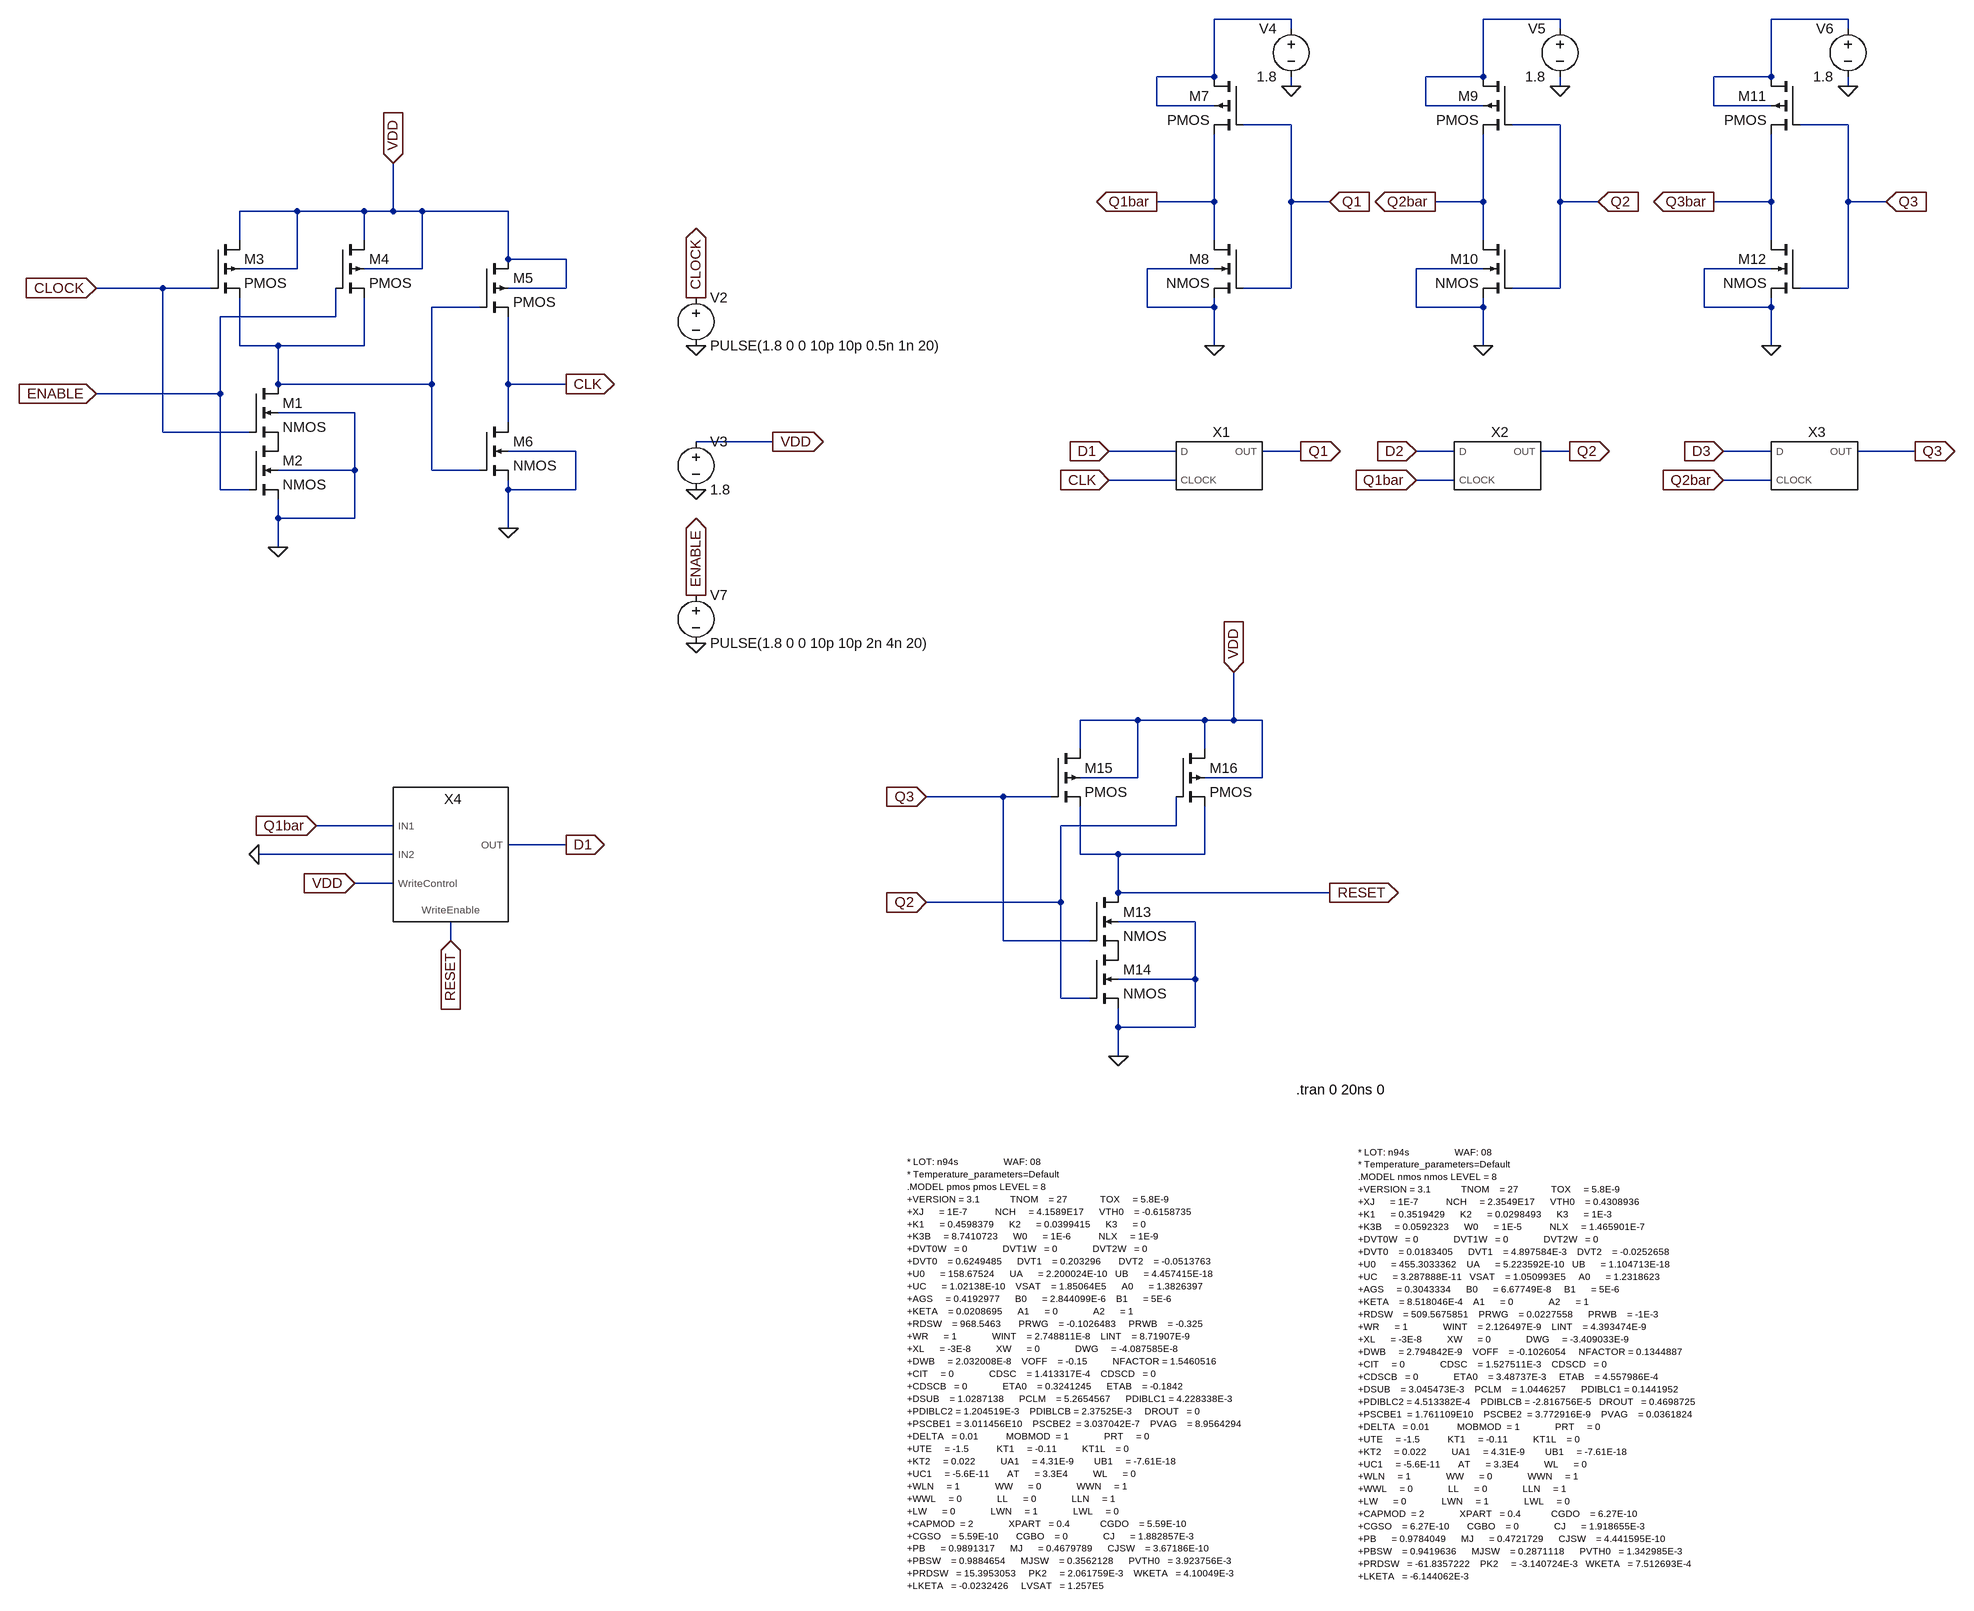
[diagram p0: schematic Mod5_Counter7.asc]
Mod5_Counter7.asc, the LTspice schematic file:
Version 4
SHEET 1 2608 2384
WIRE 16 -208 -112 -208
WIRE 464 -208 336 -208
WIRE 944 -208 816 -208
WIRE 16 -192 16 -208
WIRE 464 -192 464 -208
WIRE 944 -192 944 -208
WIRE -112 -112 -112 -208
WIRE -112 -112 -208 -112
WIRE 336 -112 336 -208
WIRE 336 -112 240 -112
WIRE 816 -112 816 -208
WIRE 816 -112 720 -112
WIRE 16 -96 16 -112
WIRE 464 -96 464 -112
WIRE 944 -96 944 -112
WIRE -208 -64 -208 -112
WIRE -112 -64 -208 -64
WIRE 240 -64 240 -112
WIRE 336 -64 240 -64
WIRE 720 -64 720 -112
WIRE 816 -64 720 -64
WIRE 16 -32 -64 -32
WIRE 464 -32 384 -32
WIRE 944 -32 864 -32
WIRE -112 96 -112 -16
WIRE -112 96 -208 96
WIRE 16 96 16 -32
WIRE 80 96 16 96
WIRE 336 96 336 -16
WIRE 336 96 256 96
WIRE 464 96 464 -32
WIRE 528 96 464 96
WIRE 816 96 816 -16
WIRE 816 96 720 96
WIRE 944 96 944 -32
WIRE 1008 96 944 96
WIRE -1744 112 -1840 112
WIRE -1632 112 -1744 112
WIRE -1584 112 -1584 32
WIRE -1584 112 -1632 112
WIRE -1536 112 -1584 112
WIRE -1392 112 -1536 112
WIRE -1840 160 -1840 112
WIRE -1632 160 -1632 112
WIRE -112 160 -112 96
WIRE 336 160 336 96
WIRE 816 160 816 96
WIRE -1392 192 -1392 112
WIRE -1296 192 -1392 192
WIRE -1744 208 -1744 112
WIRE -1744 208 -1840 208
WIRE -1536 208 -1536 112
WIRE -1536 208 -1632 208
WIRE -112 208 -224 208
WIRE 336 208 224 208
WIRE 816 208 704 208
WIRE -1968 240 -2096 240
WIRE -1888 240 -1968 240
WIRE -1296 240 -1296 192
WIRE -1296 240 -1392 240
WIRE 16 240 16 96
WIRE 16 240 -64 240
WIRE 464 240 464 96
WIRE 464 240 384 240
WIRE 944 240 944 96
WIRE 944 240 864 240
WIRE -1440 272 -1520 272
WIRE -224 272 -224 208
WIRE -112 272 -112 256
WIRE -112 272 -224 272
WIRE 224 272 224 208
WIRE 336 272 336 256
WIRE 336 272 224 272
WIRE 704 272 704 208
WIRE 816 272 816 256
WIRE 816 272 704 272
WIRE -1680 288 -1680 240
WIRE -1680 288 -1872 288
WIRE -1840 336 -1840 256
WIRE -1776 336 -1840 336
WIRE -1632 336 -1632 256
WIRE -1632 336 -1776 336
WIRE -112 336 -112 272
WIRE 336 336 336 272
WIRE 816 336 816 272
WIRE -1776 400 -1776 336
WIRE -1520 400 -1520 272
WIRE -1520 400 -1776 400
WIRE -1392 400 -1392 288
WIRE -1296 400 -1392 400
WIRE -1872 416 -1872 288
WIRE -1872 416 -2096 416
WIRE -1648 448 -1776 448
WIRE -1392 464 -1392 400
WIRE -1968 480 -1968 240
WIRE -1824 480 -1968 480
WIRE -848 496 -976 496
WIRE -1280 512 -1392 512
WIRE -176 512 -288 512
WIRE 32 512 -32 512
WIRE 288 512 224 512
WIRE 480 512 432 512
WIRE 816 512 736 512
WIRE 1056 512 960 512
WIRE -1648 544 -1648 448
WIRE -1648 544 -1776 544
WIRE -1520 544 -1520 400
WIRE -1440 544 -1520 544
WIRE -176 560 -288 560
WIRE 288 560 224 560
WIRE 816 560 736 560
WIRE -1872 576 -1872 416
WIRE -1824 576 -1872 576
WIRE -1392 576 -1392 560
WIRE -1280 576 -1280 512
WIRE -1280 576 -1392 576
WIRE -1776 624 -1776 592
WIRE -1648 624 -1648 544
WIRE -1648 624 -1776 624
WIRE -1392 640 -1392 576
WIRE -1776 672 -1776 624
WIRE -240 960 -336 960
WIRE -128 960 -240 960
WIRE -80 960 -80 880
WIRE -80 960 -128 960
WIRE -32 960 -80 960
WIRE -336 1008 -336 960
WIRE -128 1008 -128 960
WIRE -240 1056 -240 960
WIRE -240 1056 -336 1056
WIRE -32 1056 -32 960
WIRE -32 1056 -128 1056
WIRE -464 1088 -592 1088
WIRE -384 1088 -464 1088
WIRE -1584 1136 -1712 1136
WIRE -176 1136 -176 1088
WIRE -176 1136 -368 1136
WIRE -1296 1168 -1392 1168
WIRE -1584 1184 -1808 1184
WIRE -336 1184 -336 1104
WIRE -272 1184 -336 1184
WIRE -128 1184 -128 1104
WIRE -128 1184 -272 1184
WIRE -1584 1232 -1648 1232
WIRE -272 1248 -272 1184
WIRE 80 1248 -272 1248
WIRE -368 1264 -368 1136
WIRE -368 1264 -592 1264
WIRE -144 1296 -272 1296
WIRE -1488 1328 -1488 1296
WIRE -464 1328 -464 1088
WIRE -320 1328 -464 1328
WIRE -144 1392 -144 1296
WIRE -144 1392 -272 1392
WIRE -368 1424 -368 1264
WIRE -320 1424 -368 1424
WIRE -272 1472 -272 1440
WIRE -144 1472 -144 1392
WIRE -144 1472 -272 1472
WIRE -272 1520 -272 1472
FLAG -976 336 0
FLAG -112 336 0
FLAG 16 -96 0
FLAG 336 336 0
FLAG 464 -96 0
FLAG 816 336 0
FLAG 944 -96 0
FLAG 80 96 Q1
IOPIN 80 96 In
FLAG 528 96 Q2
IOPIN 528 96 In
FLAG 1008 96 Q3
IOPIN 1008 96 In
FLAG 736 512 D3
IOPIN 736 512 In
FLAG 736 560 Q2bar
IOPIN 736 560 In
FLAG 224 512 D2
IOPIN 224 512 In
FLAG 224 560 Q1bar
IOPIN 224 560 In
FLAG -288 512 D1
IOPIN -288 512 In
FLAG -288 560 CLK
IOPIN -288 560 In
FLAG 32 512 Q1
IOPIN 32 512 Out
FLAG 480 512 Q2
IOPIN 480 512 Out
FLAG 1056 512 Q3
IOPIN 1056 512 Out
FLAG 720 96 Q3bar
IOPIN 720 96 Out
FLAG 256 96 Q2bar
IOPIN 256 96 Out
FLAG -208 96 Q1bar
IOPIN -208 96 Out
FLAG -976 256 CLOCK
IOPIN -976 256 Out
FLAG -1712 1136 Q1bar
IOPIN -1712 1136 In
FLAG -976 576 0
FLAG -1296 1168 D1
IOPIN -1296 1168 Out
FLAG -848 496 VDD
IOPIN -848 496 Out
FLAG -1488 1328 RESET
IOPIN -1488 1328 In
FLAG -2096 240 CLOCK
IOPIN -2096 240 In
FLAG -1776 672 0
FLAG -1296 400 CLK
IOPIN -1296 400 Out
FLAG -1392 640 0
FLAG -1584 32 VDD
IOPIN -1584 32 In
FLAG -2096 416 ENABLE
IOPIN -2096 416 In
FLAG -976 832 0
FLAG -976 752 ENABLE
IOPIN -976 752 Out
FLAG -592 1088 Q3
IOPIN -592 1088 In
FLAG -272 1520 0
FLAG 80 1248 RESET
IOPIN 80 1248 Out
FLAG -80 880 VDD
IOPIN -80 880 In
FLAG -592 1264 Q2
IOPIN -592 1264 In
FLAG -1648 1232 VDD
IOPIN -1648 1232 In
FLAG -1808 1184 0
SYMBOL Voltage -976 240 R0
SYMATTR InstName V2
SYMATTR Value PULSE(1.8 0 0 10p 10p 0.5n 1n 20)
SYMBOL pmos4 -64 -112 M0
SYMATTR InstName M7
SYMATTR Value2 l=180n w=880n
SYMBOL nmos4 -64 160 M0
SYMATTR InstName M8
SYMATTR Value2 l=180n w=440n
SYMBOL Voltage 16 -208 M0
SYMATTR InstName V4
SYMATTR Value 1.8
SYMBOL pmos4 384 -112 M0
SYMATTR InstName M9
SYMATTR Value2 l=180n w=880n
SYMBOL nmos4 384 160 M0
SYMATTR InstName M10
SYMATTR Value2 l=180n w=440n
SYMBOL Voltage 464 -208 M0
SYMATTR InstName V5
SYMATTR Value 1.8
SYMBOL pmos4 864 -112 M0
SYMATTR InstName M11
SYMATTR Value2 l=180n w=880n
SYMBOL nmos4 864 160 M0
SYMATTR InstName M12
SYMATTR Value2 l=180n w=440n
SYMBOL Voltage 944 -208 M0
SYMATTR InstName V6
SYMATTR Value 1.8
SYMBOL DFF_Using_Mux -112 528 R0
SYMATTR InstName X1
SYMBOL DFF_Using_Mux 352 528 R0
SYMATTR InstName X2
SYMBOL DFF_Using_Mux 880 528 R0
SYMATTR InstName X3
SYMBOL Voltage -976 480 R0
SYMATTR InstName V3
SYMATTR Value 1.8
SYMBOL nmos4 -1824 400 R0
SYMATTR InstName M1
SYMATTR Value2 l=180n w=880n
SYMBOL nmos4 -1824 496 R0
SYMATTR InstName M2
SYMATTR Value2 l=180n w=880n
SYMBOL pmos4 -1888 160 R0
SYMATTR InstName M3
SYMATTR Value2 l=180n w=880n
SYMBOL pmos4 -1680 160 R0
SYMATTR InstName M4
SYMATTR Value2 l=180n w=880n
SYMBOL pmos4 -1440 192 R0
SYMATTR InstName M5
SYMATTR Value2 l=180n w=880n
SYMBOL nmos4 -1440 464 R0
SYMATTR InstName M6
SYMATTR Value2 l=180n w=440n
SYMBOL Voltage -976 736 R0
SYMATTR InstName V7
SYMATTR Value PULSE(1.8 0 0 10p 10p 2n 4n 20)
SYMBOL nmos4 -320 1248 R0
SYMATTR InstName M13
SYMATTR Value2 l=180n w=880n
SYMBOL nmos4 -320 1344 R0
SYMATTR InstName M14
SYMATTR Value2 l=180n w=880n
SYMBOL pmos4 -384 1008 R0
SYMATTR InstName M15
SYMATTR Value2 l=180n w=880n
SYMBOL pmos4 -176 1008 R0
SYMATTR InstName M16
SYMATTR Value2 l=180n w=880n
SYMBOL 2x1_MUX -1456 1216 R0
SYMATTR InstName X4
TEXT -624 1696 Left 1 !* LOT: n94s                  WAF: 08\n* Temperature_parameters=Default\n.MODEL pmos pmos LEVEL = 8\n+VERSION = 3.1            TNOM    = 27             TOX     = 5.8E-9\n+XJ      = 1E-7           NCH     = 4.1589E17      VTH0    = -0.6158735\n+K1      = 0.4598379      K2      = 0.0399415      K3      = 0\n+K3B     = 8.7410723      W0      = 1E-6           NLX     = 1E-9\n+DVT0W   = 0              DVT1W   = 0              DVT2W   = 0\n+DVT0    = 0.6249485      DVT1    = 0.203296       DVT2    = -0.0513763\n+U0      = 158.67524      UA      = 2.200024E-10   UB      = 4.457415E-18\n+UC      = 1.02138E-10    VSAT    = 1.85064E5      A0      = 1.3826397\n+AGS     = 0.4192977      B0      = 2.844099E-6    B1      = 5E-6\n+KETA    = 0.0208695      A1      = 0              A2      = 1\n+RDSW    = 968.5463       PRWG    = -0.1026483     PRWB    = -0.325\n+WR      = 1              WINT    = 2.748811E-8    LINT    = 8.71907E-9\n+XL      = -3E-8          XW      = 0              DWG     = -4.087585E-8\n+DWB     = 2.032008E-8    VOFF    = -0.15          NFACTOR = 1.5460516\n+CIT     = 0              CDSC    = 1.413317E-4    CDSCD   = 0\n+CDSCB   = 0              ETA0    = 0.3241245      ETAB    = -0.1842\n+DSUB    = 1.0287138      PCLM    = 5.2654567      PDIBLC1 = 4.228338E-3\n+PDIBLC2 = 1.204519E-3    PDIBLCB = 2.37525E-3     DROUT   = 0\n+PSCBE1  = 3.011456E10    PSCBE2  = 3.037042E-7    PVAG    = 8.9564294\n+DELTA   = 0.01           MOBMOD  = 1              PRT     = 0\n+UTE     = -1.5           KT1     = -0.11          KT1L    = 0\n+KT2     = 0.022          UA1     = 4.31E-9        UB1     = -7.61E-18\n+UC1     = -5.6E-11       AT      = 3.3E4          WL      = 0\n+WLN     = 1              WW      = 0              WWN     = 1\n+WWL     = 0              LL      = 0              LLN     = 1\n+LW      = 0              LWN     = 1              LWL     = 0\n+CAPMOD  = 2              XPART   = 0.4            CGDO    = 5.59E-10\n+CGSO    = 5.59E-10       CGBO    = 0              CJ      = 1.882857E-3\n+PB      = 0.9891317      MJ      = 0.4679789      CJSW    = 3.67186E-10\n+PBSW    = 0.9884654      MJSW    = 0.3562128      PVTH0   = 3.923756E-3\n+PRDSW   = 15.3953053     PK2     = 2.061759E-3    WKETA   = 4.10049E-3\n+LKETA   = -0.0232426     LVSAT   = 1.257E5
TEXT 128 1680 Left 1 !* LOT: n94s                  WAF: 08\n* Temperature_parameters=Default\n.MODEL nmos nmos LEVEL = 8\n+VERSION = 3.1            TNOM    = 27             TOX     = 5.8E-9\n+XJ      = 1E-7           NCH     = 2.3549E17      VTH0    = 0.4308936\n+K1      = 0.3519429      K2      = 0.0298493      K3      = 1E-3\n+K3B     = 0.0592323      W0      = 1E-5           NLX     = 1.465901E-7\n+DVT0W   = 0              DVT1W   = 0              DVT2W   = 0\n+DVT0    = 0.0183405      DVT1    = 4.897584E-3    DVT2    = -0.0252658\n+U0      = 455.3033362    UA      = 5.223592E-10   UB      = 1.104713E-18\n+UC      = 3.287888E-11   VSAT    = 1.050993E5     A0      = 1.2318623\n+AGS     = 0.3043334      B0      = 6.67749E-8     B1      = 5E-6\n+KETA    = 8.518046E-4    A1      = 0              A2      = 1\n+RDSW    = 509.5675851    PRWG    = 0.0227558      PRWB    = -1E-3\n+WR      = 1              WINT    = 2.126497E-9    LINT    = 4.393474E-9\n+XL      = -3E-8          XW      = 0              DWG     = -3.409033E-9\n+DWB     = 2.794842E-9    VOFF    = -0.1026054     NFACTOR = 0.1344887\n+CIT     = 0              CDSC    = 1.527511E-3    CDSCD   = 0\n+CDSCB   = 0              ETA0    = 3.48737E-3     ETAB    = 4.557986E-4\n+DSUB    = 3.045473E-3    PCLM    = 1.0446257      PDIBLC1 = 0.1441952\n+PDIBLC2 = 4.513382E-4    PDIBLCB = -2.816756E-5   DROUT   = 0.4698725\n+PSCBE1  = 1.761109E10    PSCBE2  = 3.772916E-9    PVAG    = 0.0361824\n+DELTA   = 0.01           MOBMOD  = 1              PRT     = 0\n+UTE     = -1.5           KT1     = -0.11          KT1L    = 0\n+KT2     = 0.022          UA1     = 4.31E-9        UB1     = -7.61E-18\n+UC1     = -5.6E-11       AT      = 3.3E4          WL      = 0\n+WLN     = 1              WW      = 0              WWN     = 1\n+WWL     = 0              LL      = 0              LLN     = 1\n+LW      = 0              LWN     = 1              LWL     = 0\n+CAPMOD  = 2              XPART   = 0.4            CGDO    = 6.27E-10\n+CGSO    = 6.27E-10       CGBO    = 0              CJ      = 1.918655E-3\n+PB      = 0.9784049      MJ      = 0.4721729      CJSW    = 4.441595E-10\n+PBSW    = 0.9419636      MJSW    = 0.2871118      PVTH0   = 1.342985E-3\n+PRDSW   = -61.8357222    PK2     = -3.140724E-3   WKETA   = 7.512693E-4\n+LKETA   = -6.144062E-3
TEXT 24 1576 Left 2 !.tran 0 20ns 0

The netlist it stands for:
* Mod5_Counter7.asc
V2 CLOCK 0 PULSE(1.8 0 0 10p 10p 0.5n 1n 20)
M7 N001 Q1 Q1bar N001 PMOS l=180n w=880n
M8 Q1bar Q1 0 0 NMOS l=180n w=440n
V4 N001 0 1.8
M9 N002 Q2 Q2bar N002 PMOS l=180n w=880n
M10 Q2bar Q2 0 0 NMOS l=180n w=440n
V5 N002 0 1.8
M11 N003 Q3 Q3bar N003 PMOS l=180n w=880n
M12 Q3bar Q3 0 0 NMOS l=180n w=440n
V6 N003 0 1.8
XX1 D1 CLK Q1 DFF_Using_Mux  ; pins D CLOCK OUT
XX2 D2 Q1bar Q2 DFF_Using_Mux  ; pins D CLOCK OUT
XX3 D3 Q2bar Q3 DFF_Using_Mux  ; pins D CLOCK OUT
V3 VDD 0 1.8
M1 N004 CLOCK P001 0 NMOS l=180n w=880n
M2 P001 ENABLE 0 0 NMOS l=180n w=880n
M3 VDD CLOCK N004 VDD PMOS l=180n w=880n
M4 VDD ENABLE N004 VDD PMOS l=180n w=880n
M5 VDD N004 CLK VDD PMOS l=180n w=880n
M6 CLK N004 0 0 NMOS l=180n w=440n
V7 ENABLE 0 PULSE(1.8 0 0 10p 10p 2n 4n 20)
M13 RESET Q3 P002 0 NMOS l=180n w=880n
M14 P002 Q2 0 0 NMOS l=180n w=880n
M15 VDD Q3 RESET VDD PMOS l=180n w=880n
M16 VDD Q2 RESET VDD PMOS l=180n w=880n
XX4 Q1bar 0 VDD RESET D1 2x1_MUX  ; pins IN1 IN2 WriteControl WriteEnable OUT
.model NMOS NMOS
.model PMOS PMOS
.lib standard.mos
* LOT: n94s                  WAF: 08
* Temperature_parameters=Default
.MODEL pmos pmos LEVEL = 8
+VERSION = 3.1            TNOM    = 27             TOX     = 5.8E-9
+XJ      = 1E-7           NCH     = 4.1589E17      VTH0    = -0.6158735
+K1      = 0.4598379      K2      = 0.0399415      K3      = 0
+K3B     = 8.7410723      W0      = 1E-6           NLX     = 1E-9
+DVT0W   = 0              DVT1W   = 0              DVT2W   = 0
+DVT0    = 0.6249485      DVT1    = 0.203296       DVT2    = -0.0513763
+U0      = 158.67524      UA      = 2.200024E-10   UB      = 4.457415E-18
+UC      = 1.02138E-10    VSAT    = 1.85064E5      A0      = 1.3826397
+AGS     = 0.4192977      B0      = 2.844099E-6    B1      = 5E-6
+KETA    = 0.0208695      A1      = 0              A2      = 1
+RDSW    = 968.5463       PRWG    = -0.1026483     PRWB    = -0.325
+WR      = 1              WINT    = 2.748811E-8    LINT    = 8.71907E-9
+XL      = -3E-8          XW      = 0              DWG     = -4.087585E-8
+DWB     = 2.032008E-8    VOFF    = -0.15          NFACTOR = 1.5460516
+CIT     = 0              CDSC    = 1.413317E-4    CDSCD   = 0
+CDSCB   = 0              ETA0    = 0.3241245      ETAB    = -0.1842
+DSUB    = 1.0287138      PCLM    = 5.2654567      PDIBLC1 = 4.228338E-3
+PDIBLC2 = 1.204519E-3    PDIBLCB = 2.37525E-3     DROUT   = 0
+PSCBE1  = 3.011456E10    PSCBE2  = 3.037042E-7    PVAG    = 8.9564294
+DELTA   = 0.01           MOBMOD  = 1              PRT     = 0
+UTE     = -1.5           KT1     = -0.11          KT1L    = 0
+KT2     = 0.022          UA1     = 4.31E-9        UB1     = -7.61E-18
+UC1     = -5.6E-11       AT      = 3.3E4          WL      = 0
+WLN     = 1              WW      = 0              WWN     = 1
+WWL     = 0              LL      = 0              LLN     = 1
+LW      = 0              LWN     = 1              LWL     = 0
+CAPMOD  = 2              XPART   = 0.4            CGDO    = 5.59E-10
+CGSO    = 5.59E-10       CGBO    = 0              CJ      = 1.882857E-3
+PB      = 0.9891317      MJ      = 0.4679789      CJSW    = 3.67186E-10
+PBSW    = 0.9884654      MJSW    = 0.3562128      PVTH0   = 3.923756E-3
+PRDSW   = 15.3953053     PK2     = 2.061759E-3    WKETA   = 4.10049E-3
+LKETA   = -0.0232426     LVSAT   = 1.257E5
* LOT: n94s                  WAF: 08
* Temperature_parameters=Default
.MODEL nmos nmos LEVEL = 8
+VERSION = 3.1            TNOM    = 27             TOX     = 5.8E-9
+XJ      = 1E-7           NCH     = 2.3549E17      VTH0    = 0.4308936
+K1      = 0.3519429      K2      = 0.0298493      K3      = 1E-3
+K3B     = 0.0592323      W0      = 1E-5           NLX     = 1.465901E-7
+DVT0W   = 0              DVT1W   = 0              DVT2W   = 0
+DVT0    = 0.0183405      DVT1    = 4.897584E-3    DVT2    = -0.0252658
+U0      = 455.3033362    UA      = 5.223592E-10   UB      = 1.104713E-18
+UC      = 3.287888E-11   VSAT    = 1.050993E5     A0      = 1.2318623
+AGS     = 0.3043334      B0      = 6.67749E-8     B1      = 5E-6
+KETA    = 8.518046E-4    A1      = 0              A2      = 1
+RDSW    = 509.5675851    PRWG    = 0.0227558      PRWB    = -1E-3
+WR      = 1              WINT    = 2.126497E-9    LINT    = 4.393474E-9
+XL      = -3E-8          XW      = 0              DWG     = -3.409033E-9
+DWB     = 2.794842E-9    VOFF    = -0.1026054     NFACTOR = 0.1344887
+CIT     = 0              CDSC    = 1.527511E-3    CDSCD   = 0
+CDSCB   = 0              ETA0    = 3.48737E-3     ETAB    = 4.557986E-4
+DSUB    = 3.045473E-3    PCLM    = 1.0446257      PDIBLC1 = 0.1441952
+PDIBLC2 = 4.513382E-4    PDIBLCB = -2.816756E-5   DROUT   = 0.4698725
+PSCBE1  = 1.761109E10    PSCBE2  = 3.772916E-9    PVAG    = 0.0361824
+DELTA   = 0.01           MOBMOD  = 1              PRT     = 0
+UTE     = -1.5           KT1     = -0.11          KT1L    = 0
+KT2     = 0.022          UA1     = 4.31E-9        UB1     = -7.61E-18
+UC1     = -5.6E-11       AT      = 3.3E4          WL      = 0
+WLN     = 1              WW      = 0              WWN     = 1
+WWL     = 0              LL      = 0              LLN     = 1
+LW      = 0              LWN     = 1              LWL     = 0
+CAPMOD  = 2              XPART   = 0.4            CGDO    = 6.27E-10
+CGSO    = 6.27E-10       CGBO    = 0              CJ      = 1.918655E-3
+PB      = 0.9784049      MJ      = 0.4721729      CJSW    = 4.441595E-10
+PBSW    = 0.9419636      MJSW    = 0.2871118      PVTH0   = 1.342985E-3
+PRDSW   = -61.8357222    PK2     = -3.140724E-3   WKETA   = 7.512693E-4
+LKETA   = -6.144062E-3
.tran 0 20ns 0
.backanno
.end